# Altium schematic sheet FuelGauge_Sheet.SchDoc: Fuel Gauge
size 420 x 297 mm; Engineer: Zain Siddiqui; Revision: V3.2
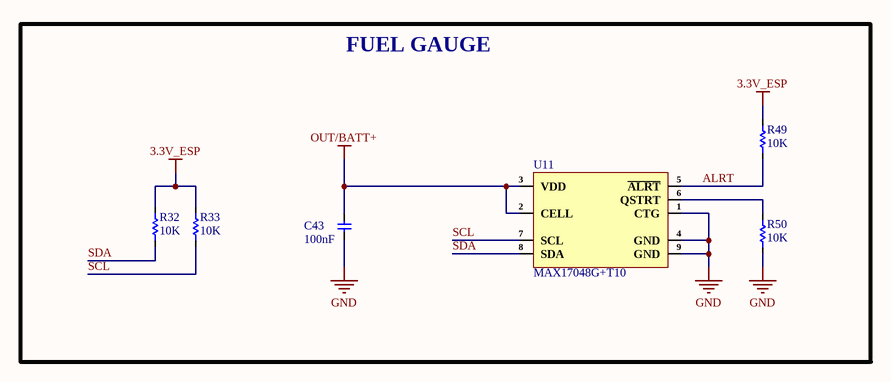
[diagram p0: FuelGauge_Sheet.SchDoc]

## Parts
C43  100nF  [cap-0402]
R32  10K  [Res-0402]
R33  10K  [Res-0402]
R49  10K  [Res-0402]
R50  10K  [Res-0402]
U11  MAX17048G+T10  [8-TDFN-EP (2x2)]

## Blocks framed on the sheet
FUEL GAUGE: C43 R32 R33 R49 R50 U11

## Nets
3.3V_ESP: R32.2 R33.2 R49.2
GND: C43.2 R50.1 U11.1(CTG) U11.4(GND) U11.9(GND)
OUT/BATT+: C43.1 U11.2(CELL) U11.3(VDD)
ALRT: R49.1 U11.5(~{ALRT})
SCL: R33.1 U11.7(SCL)
SDA: R32.1 U11.8(SDA)
NetR50_2: R50.2 U11.6(QSTRT)

## Notes on the sheet
- PROJECT
- TITLE
- DATE
- FILE NAME
- A3
- SIZE
- ENGINEER
- SHEET
- REV
- OF

## Library data of the parts
C43 = C1005X7R1H104KT000F: CAP CER 0.1UF 50V X7R 0402; Manufacturer: TDK; Tolerance: 10%; Voltage: 25V; Item Type: Capacitor; Supplier 1: Avnet; Manufacturer Part Number: C1005X7R1H104KT000F; RoHS: No; Category: Ceramic Capacitors; Dielectric: X7R; Supplier Part Number 1: C1005X7R1H104KT000F; LCSC Part Number: C361198; ComponentLink1Description: LCSC; ComponentLink1URL: https://www.lcsc.com/product-detail/Multilayer-Ceramic-Capacitors-MLCC-SMD-SMT_TDK-C1005X7R1H104KT000F_C361198.html
R32 R33 R49 R50 = RC0402FR-0710KL: RES 10K OHM 1% 1/16W 0402; Manufacturer: Yageo; Resistance: 10kR; Voltage Rating (DC): 50V; Temperature Coefficient: 100ppm/°C; Power Rating: 62.5mW; Max Power Dissipation: 63mW; Item Type: Resistor; Supplier 1: Mouser; Manufacturer Part Number: RC0402FR-0710KL; RoHS: Yes; Category: Chip SMD Resistors; Stock 1: 18648329; Pricing 1: 1=0.10000, 10=0.01400, 50=0.01400, 100=0.00500, 1000=0.00300, 10000=0.00200 (USD); Case/Package: 0402; Number of Pins: 2; Case Code (Imperial): 0402; Case Code (Metric): 1005; Min Operating Temperature: -55°C; Max Operating Temperature: 155°C; Resistor Type: Thick Film; Tolerance: 1%; Packaging: Tape and Reel; Voltage Rating: 50V; Termination: SMD/SMT; Working Voltage: 50V; Number of Terminations: 2; Features: Moisture Resistant; Series: RC; Resistance Tolerance: 1%; Construction: Rectangular; Length: 1mm; Width: 0.5mm; Height: 0.32mm; Depth: 0.5mm; Lead Pitch: 0.2mm; REACH SVHC: No SVHC; Lead Free: Lead Free; RoHS Compliant: Yes; Military Standard: Not; ComponentLink1URL: https://datasheet.ciiva.com/7660/38568-7660787.pdf?src-supplier=Element14; ComponentLink1Description: https://datasheet.ciiva.com/7660/38568-7660787.pdf?src-supplier=Element14; ComponentLink2URL: https://datasheet.ciiva.com/7849/1686128-7849814.pdf?src-supplier=Element14; ComponentLink2Description: https://datasheet.ciiva.com/7849/1686128-7849814.pdf?src-supplier=Element14; ComponentLink3URL: https://datasheet.ciiva.com/7983/1018594-7983486.pdf?src-supplier=Element14; ComponentLink3Description: https://datasheet.ciiva.com/7983/1018594-7983486.pdf?src-supplier=Element14; ComponentLink4URL: https://datasheet.ciiva.com/22747/1018594-22747512.pdf?src-supplier=Element14; ComponentLink4Description: https://datasheet.ciiva.com/22747/1018594-22747512.pdf?src-supplier=Element14; ComponentLink5URL: https://datasheet.ciiva.com/12667/pyu-rc0402-51-rohs-l-6-r-12667067.pdf?src-supplier=Mouser; ComponentLink5Description: https://datasheet.ciiva.com/12667/pyu-rc0402-51-rohs-l-6-r-12667067.pdf?src-supplier=Mouser; ComponentLink6URL: https://datasheet.ciiva.com/7849/1784430-7849813.pdf?src-supplier=Element14; ComponentLink6Description: https://datasheet.ciiva.com/7849/1784430-7849813.pdf?src-supplier=Element14; ComponentLink7URL: https://datasheet.ciiva.com/7849/1784430-7849815.pdf?src-supplier=Element14; ComponentLink7Description: https://datasheet.ciiva.com/7849/1784430-7849815.pdf?src-supplier=Element14; Supplier Part Number 1: 603-RC0402FR-0710KL; LCSC Part Number: C60490
U11 = MAX17048G+T10: IC BATT MON LI-ION 1CELL 8TDFN; Manufacturer: Maxim; Output Voltage: 400mV; Operating Supply Current: 23uA; Operating Supply Voltage: 4.5V; Supplier 1: Mouser; Manufacturer Part Number: MAX17048G+T10; RoHS: Yes; Category: Battery Management; Stock 1: 41293; Pricing 1: 1=3.34000, 10=3.00000, 50=2.84000, 100=2.46000, 1000=1.89000, 10000=1.83000 (USD); Mount: Surface Mount; Number of Pins: 8; Contact Plating: Tin,Matte; Min Operating Temperature: -20°C; Max Operating Temperature: 85°C; Packaging: Tape and Reel; Package Quantity: 10000; Series: ModelGauge™; Radiation Hardening: No; RoHS Compliant: Yes; ComponentLink1URL: https://datasheet.ciiva.com/14083/max17048-max17049-14083973.pdf?src-supplier=Digi-Key; ComponentLink1Description: https://datasheet.ciiva.com/14083/max17048-max17049-14083973.pdf?src-supplier=Digi-Key; Supplier Part Number 1: 700-MAX17048G+T10; LCSC Part Number: C2682616; Item Type: IC